# EAGLE design airball_sensor_board_v7 (EAGLE 9.4.2)

## Sheet 1 of 3
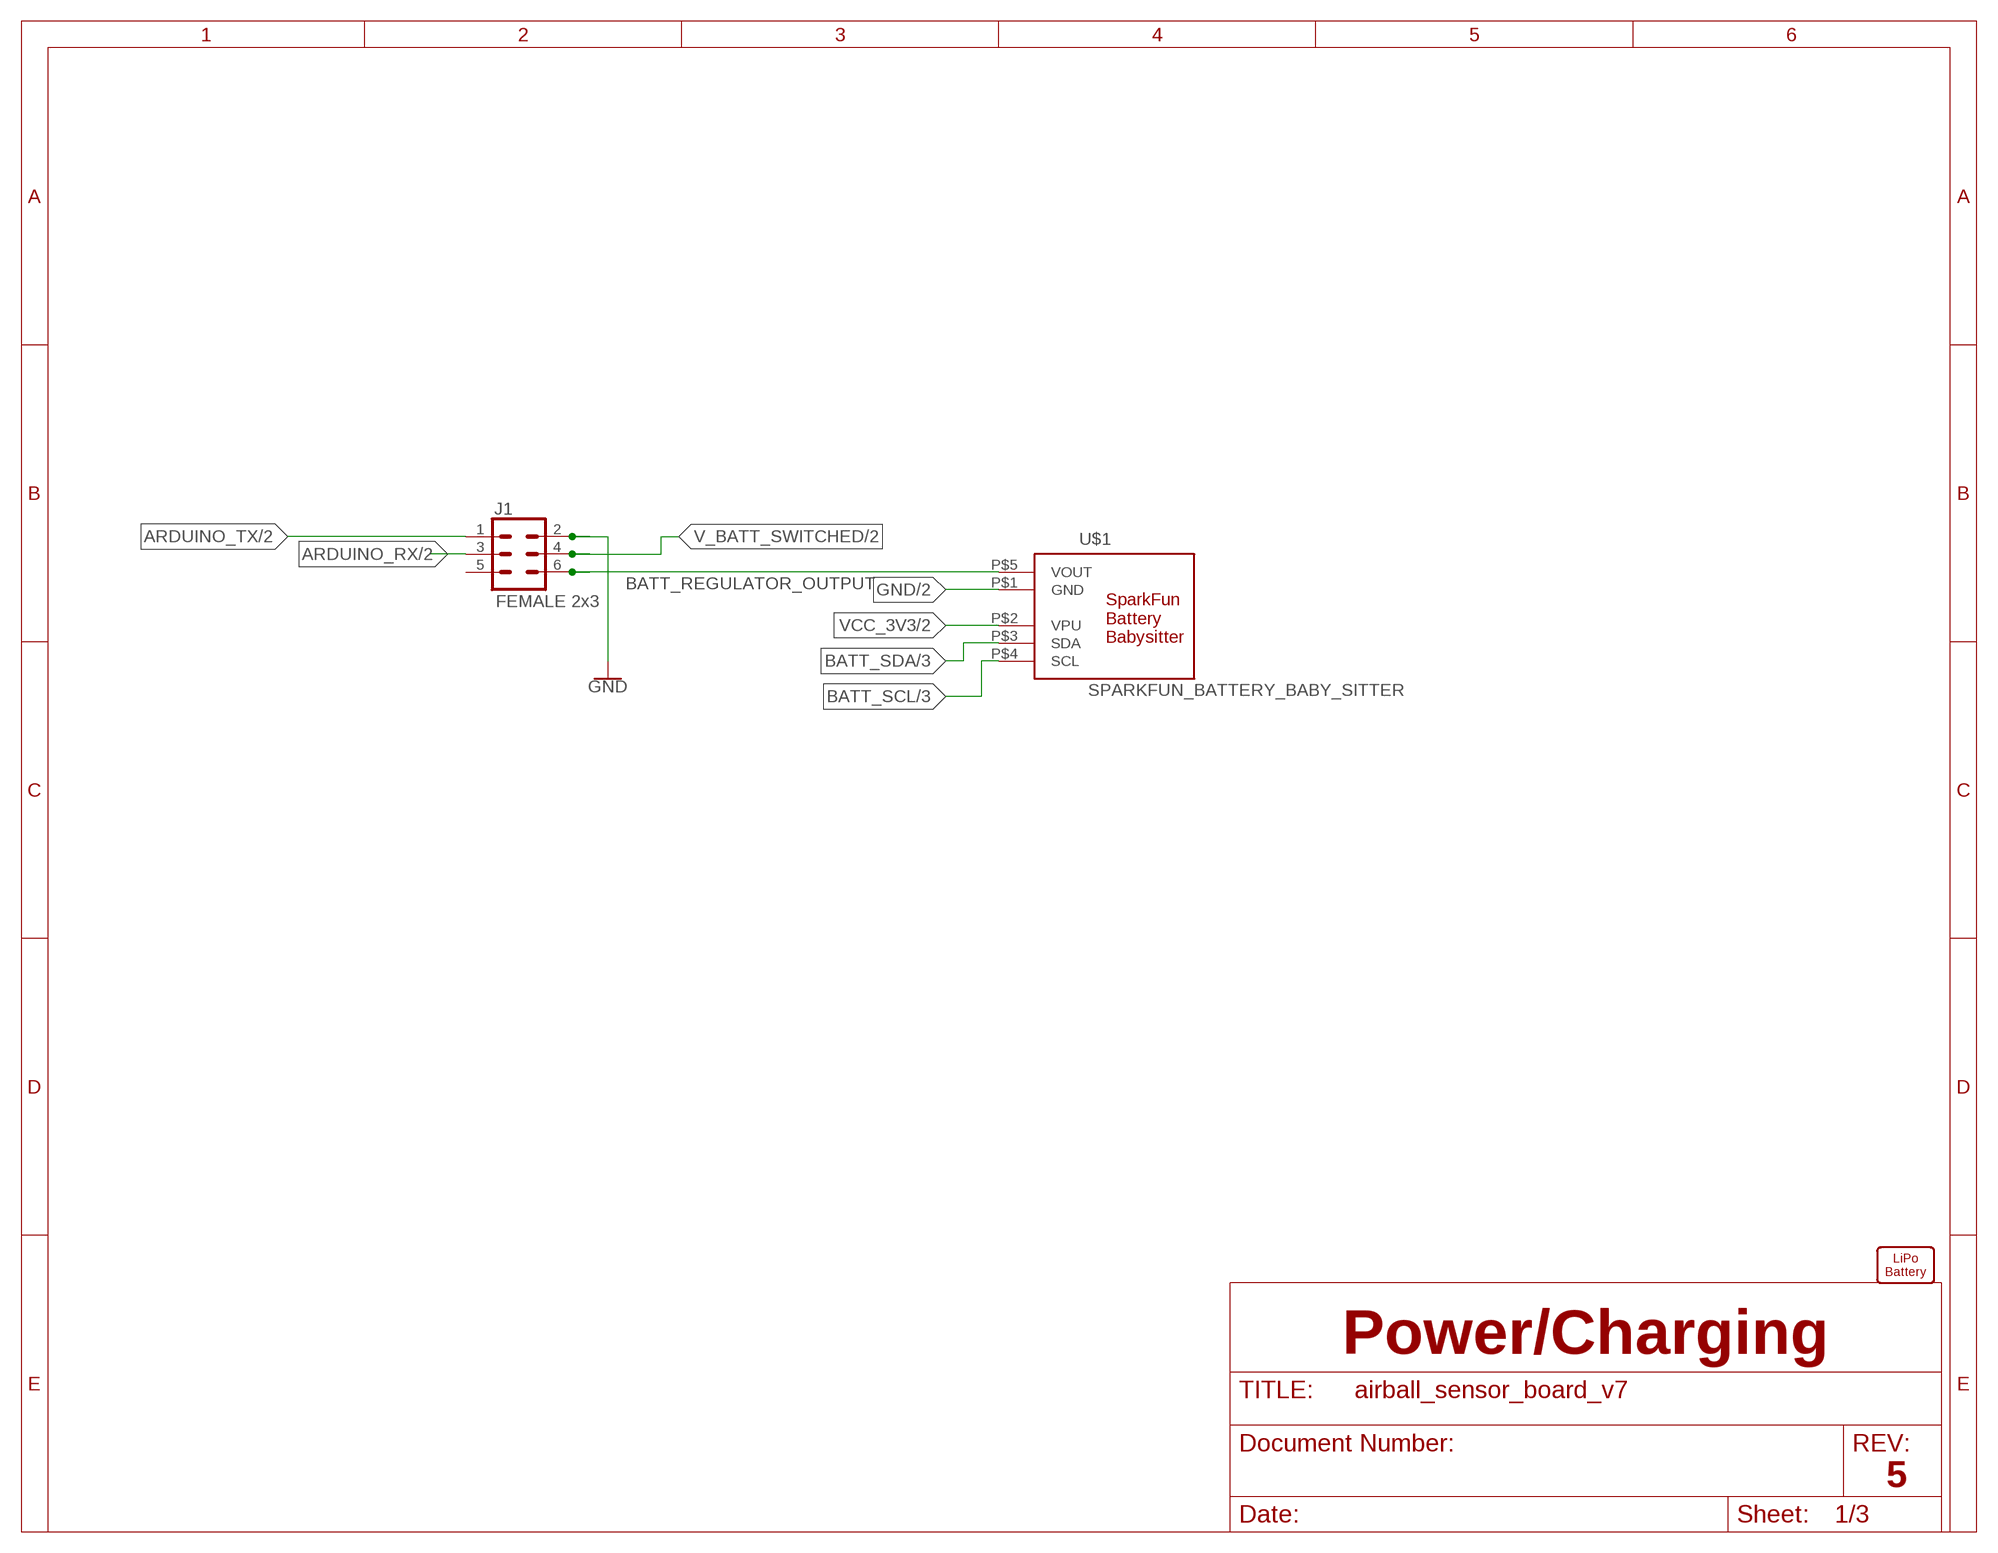
[diagram p0: schematic, sheet 1]

### Parts
J1  FEMALE 2x3  CONN_03X2FEMALE  [2X3]
U$1  SPARKFUN_BATTERY_BABY_SITTER  [SPARKFUN_BATTERY_BABY_SITTER]
U$3  LIPO_BATTERY_OUTLINE-1000MAH  [SPARKFUN_LIPO_1000MAH]

### Nets
ARDUINO_RX: J1.3 ; also sheet 2
ARDUINO_TX: J1.1 ; also sheet 2
BATT_REGULATOR_OUTPUT: J1.6 U$1.P$5(VOUT)
BATT_SCL: U$1.P$4(SCL) ; also sheet 3
BATT_SDA: U$1.P$3(SDA) ; also sheet 3
GND [power]: J1.2 U$1.P$1(GND) ; also sheet 2,3
V_BATT_SWITCHED: J1.4 ; also sheet 2
VCC_3V3 [power]: U$1.P$2(VPU) ; also sheet 2,3
Unconnected: J1.5

### Notes on the sheet
- Power/Charging
- 5

## Sheet 2 of 3
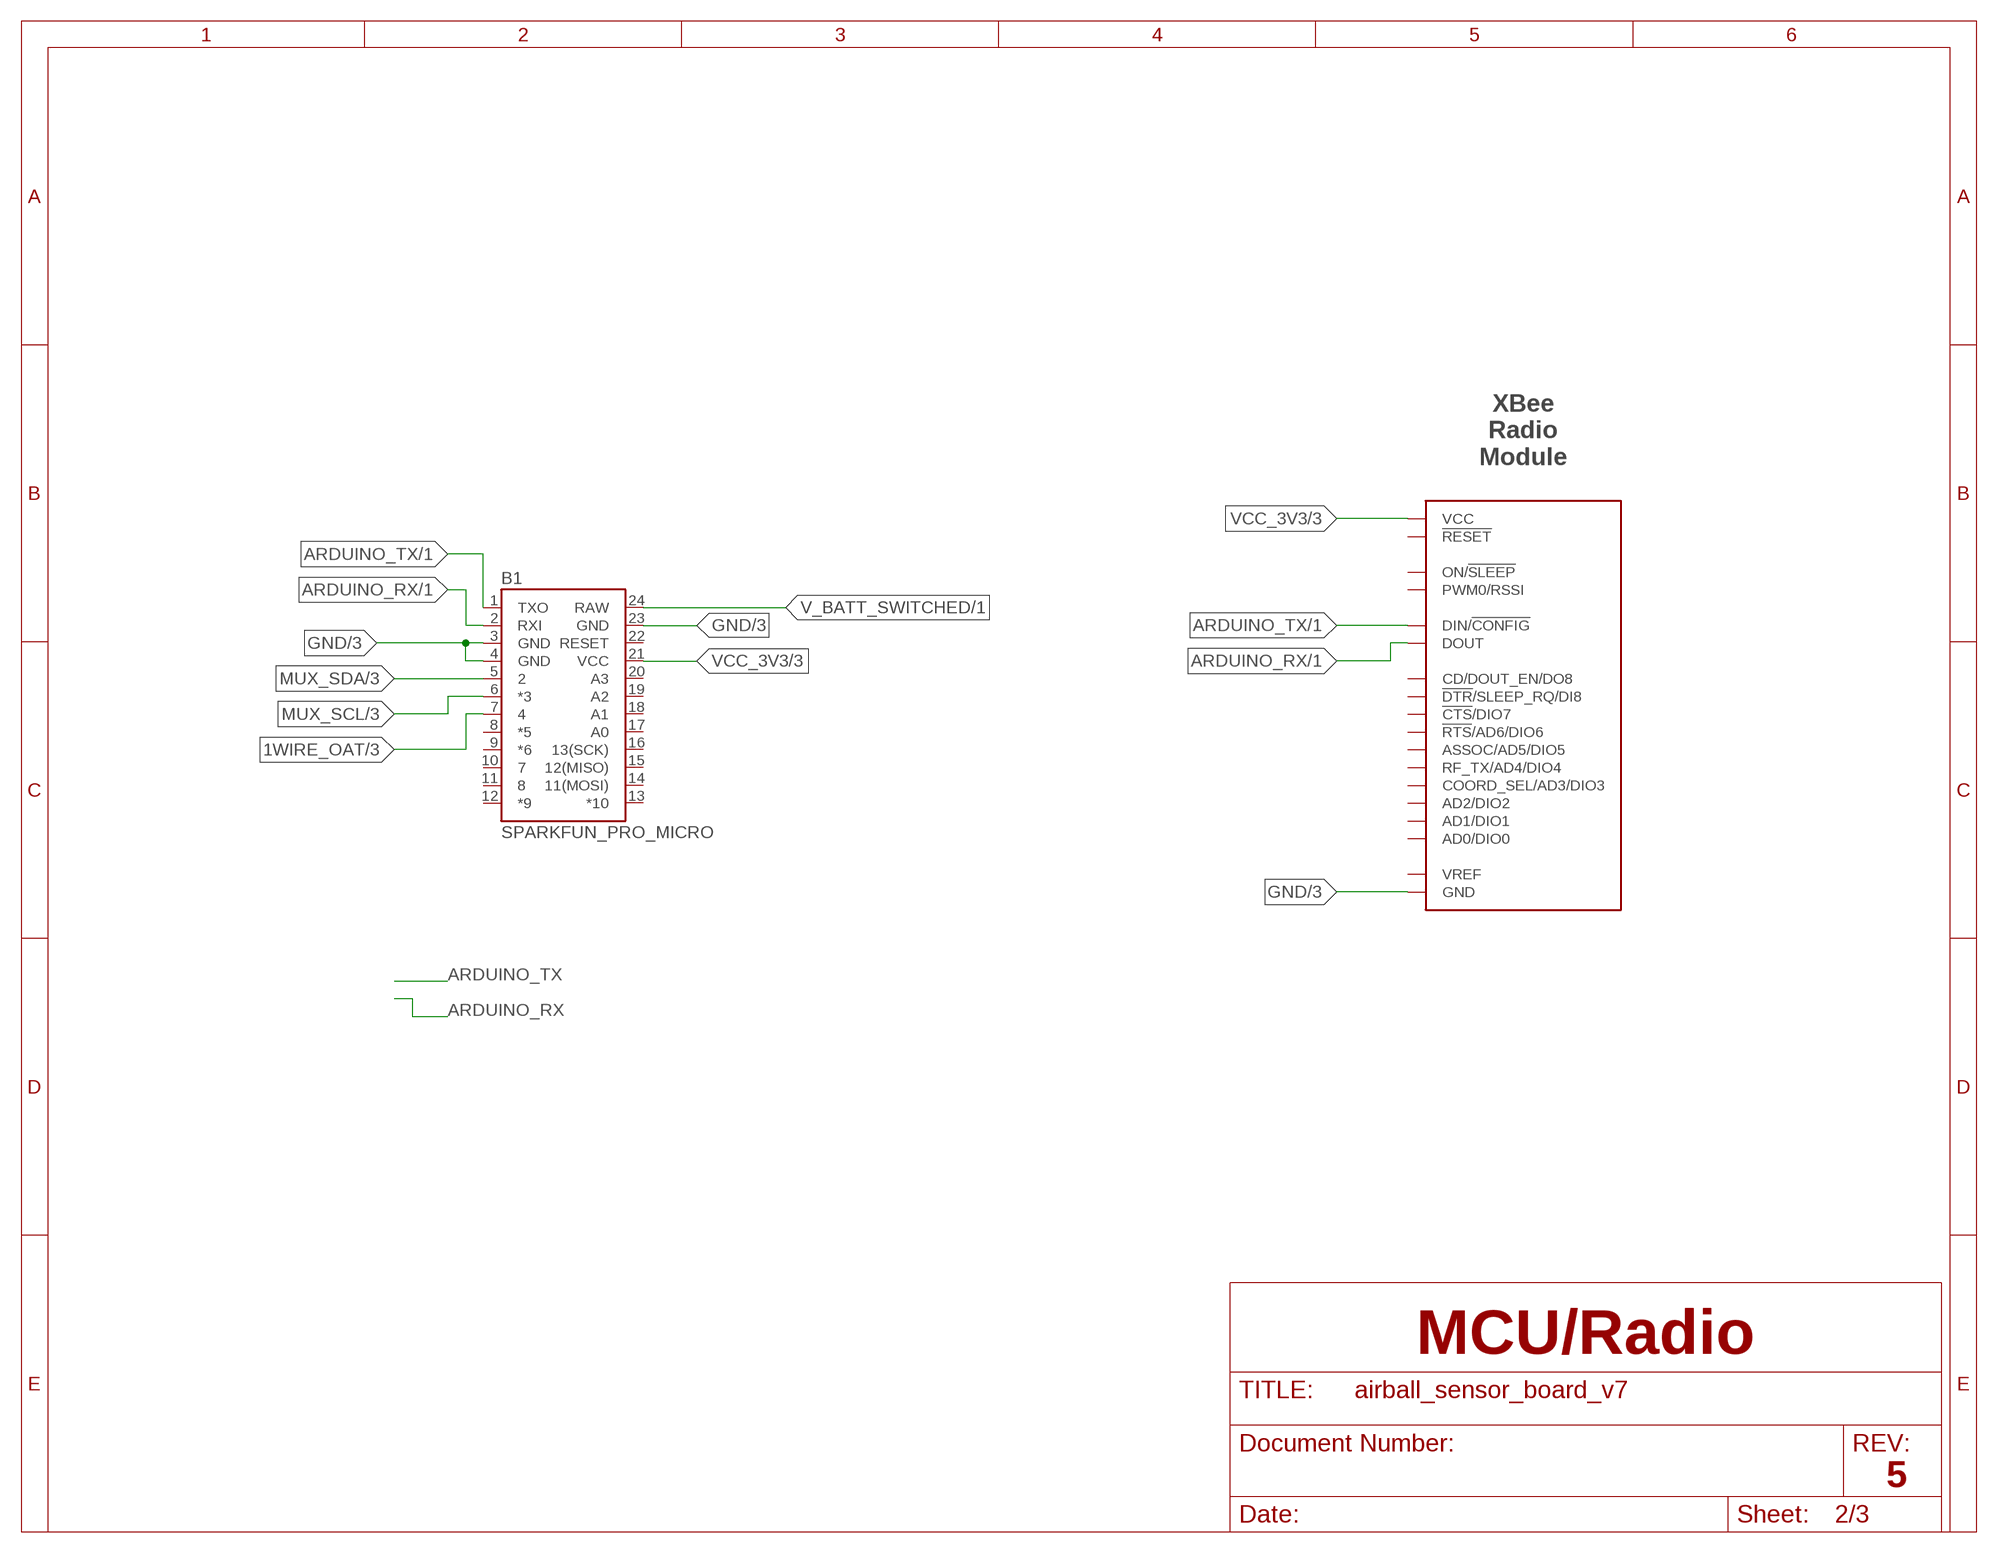
[diagram p1: schematic, sheet 2]

### Parts
B1  SPARKFUN_PRO_MICRO  [SPARKFUN_PRO_MICRO]
XBEE  XBEE-PRO-SMD  [XBEE-PRO-SMD]

### Nets
1WIRE_OAT: B1.7 ; also sheet 3
ARDUINO_RX: B1.2(RXI) XBEE.2(DOUT) ; also sheet 1
ARDUINO_TX: B1.1(TXO) XBEE.3(DIN/!CONFIG) ; also sheet 1
GND [power]: B1.3(GND) B1.4(GND) B1.23(GND) XBEE.10(GND) ; also sheet 1,3
MUX_SCL: B1.6(*3) ; also sheet 3
MUX_SDA: B1.5 ; also sheet 3
V_BATT_SWITCHED: B1.24(RAW) ; also sheet 1
VCC_3V3 [power]: B1.21(VCC) XBEE.1(VCC) ; also sheet 1,3
Unconnected: B1.8(*5) B1.9(*6) B1.10 B1.11 B1.12(*9) B1.13(*10) B1.14(11(MOSI)) B1.15(12(MISO)) B1.16(13(SCK)) B1.17(A0) B1.18(A1) B1.19(A2) B1.20(A3) B1.22(RESET) XBEE.4(CD/DOUT_EN/DO8) XBEE.5(!RESET) XBEE.6(PWM0/RSSI) XBEE.9(!DTR!/SLEEP_RQ/DI8) XBEE.11(RF_TX/AD4/DIO4) XBEE.12(!CTS!/DIO7) XBEE.13(ON/!SLEEP) XBEE.14(VREF) XBEE.15(ASSOC/AD5/DIO5) XBEE.16(!RTS!/AD6/DIO6) XBEE.17(COORD_SEL/AD3/DIO3) XBEE.18(AD2/DIO2) XBEE.19(AD1/DIO1) XBEE.20(AD0/DIO0)

### Notes on the sheet
- XBee
  Radio
  Module
- MCU/Radio
- 5

## Sheet 3 of 3
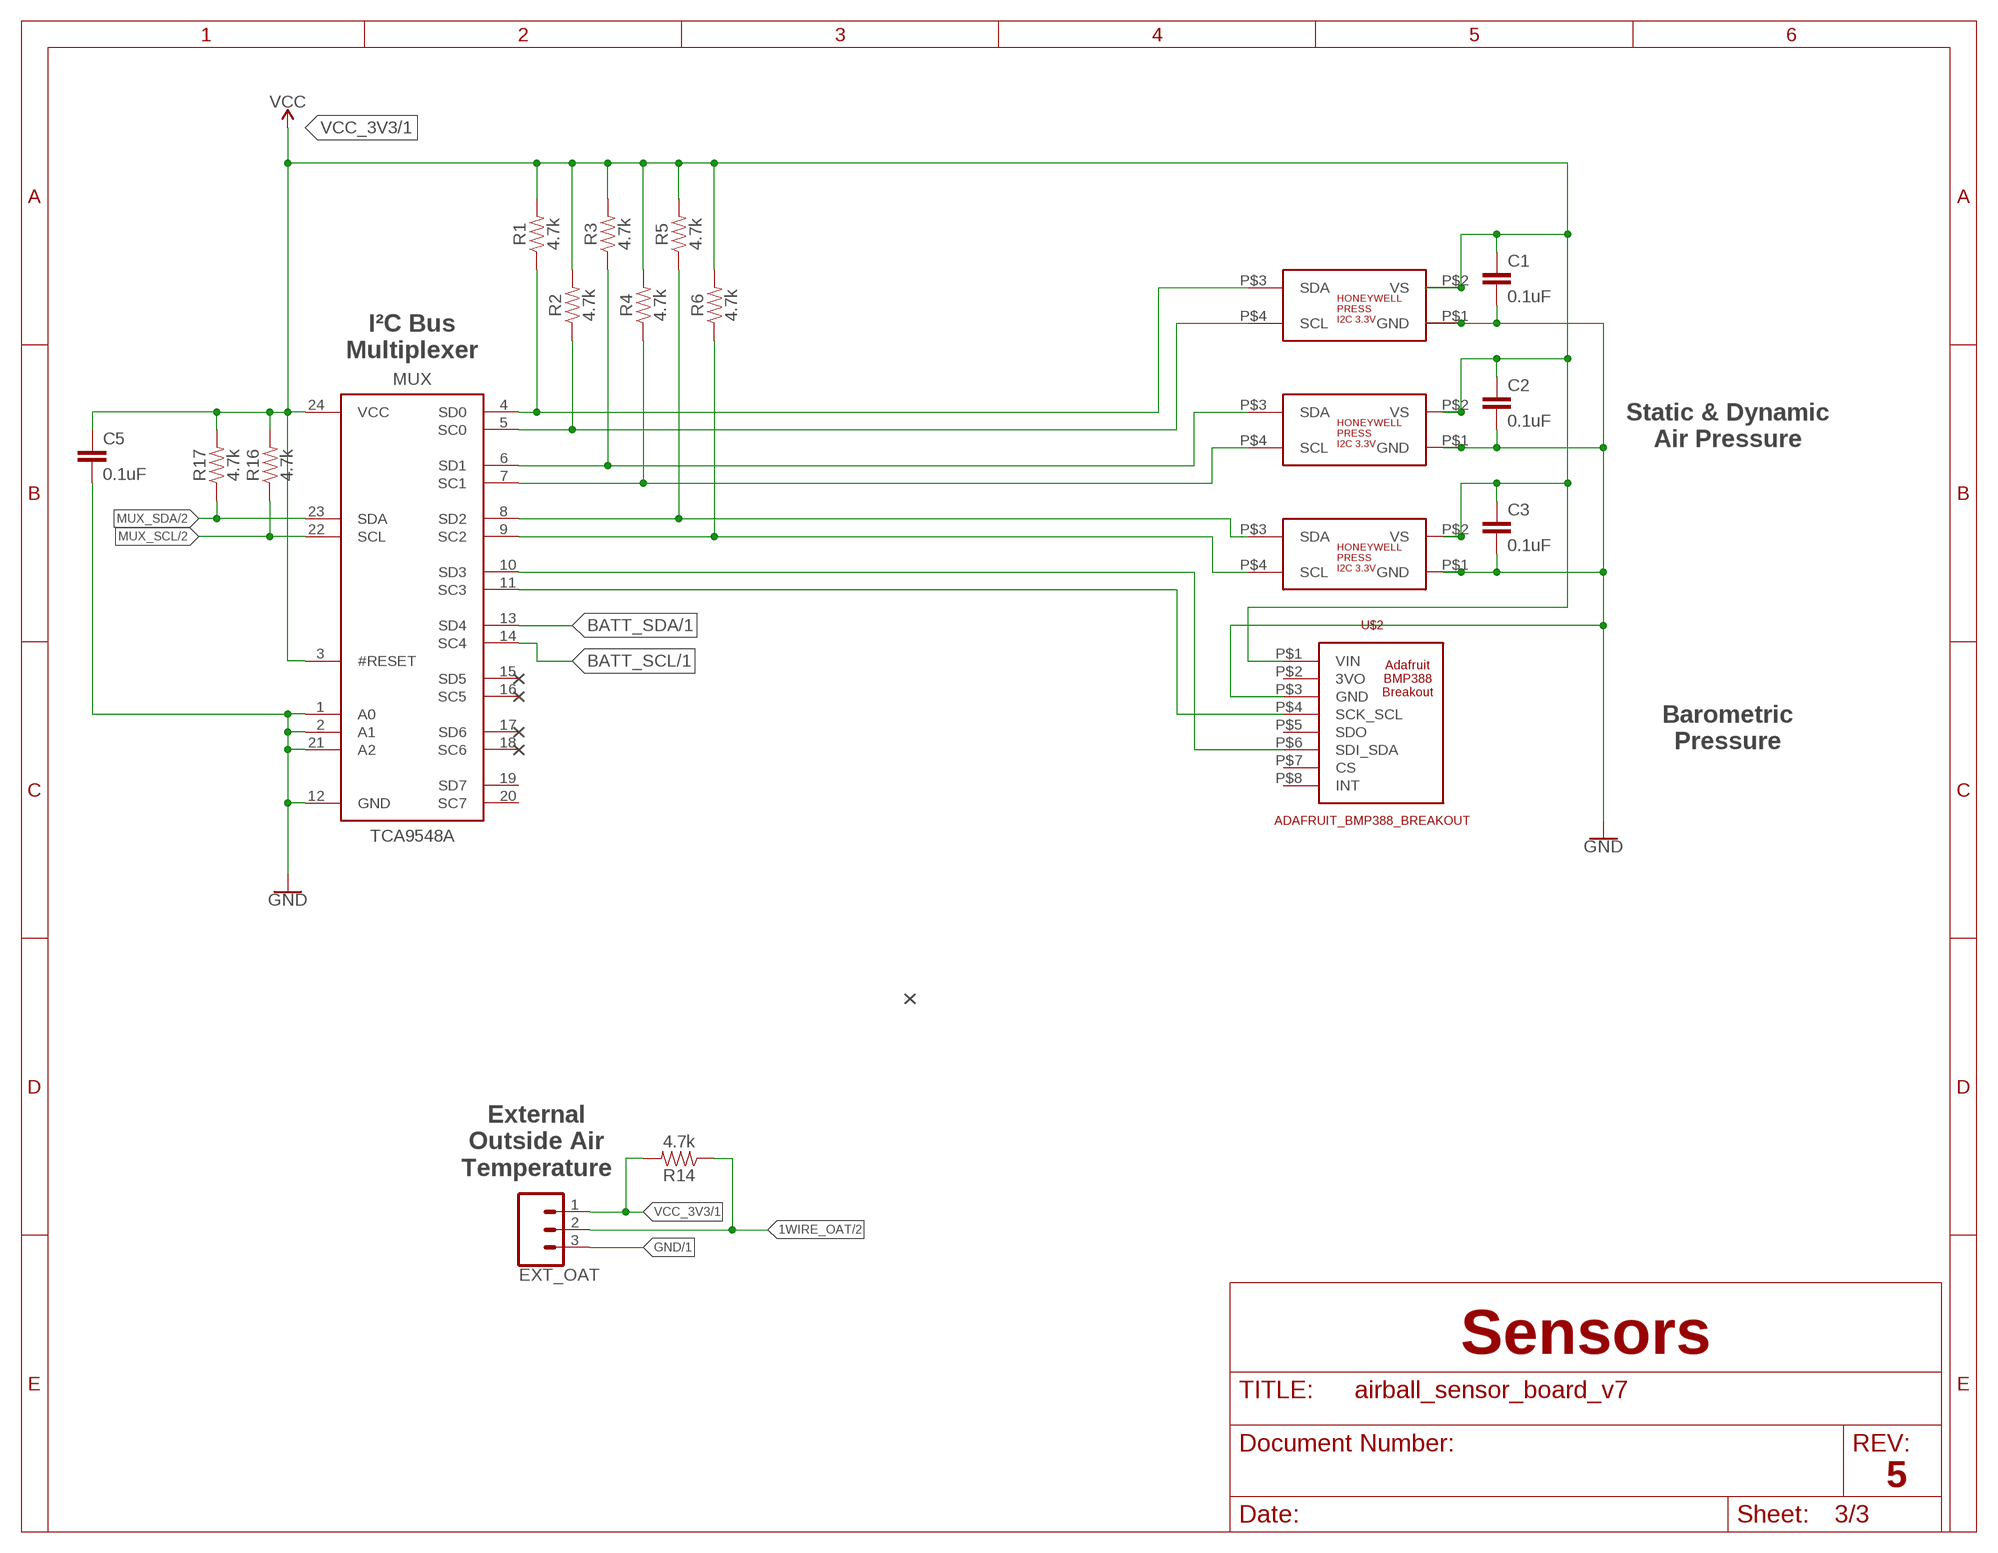
[diagram p2: schematic, sheet 3]

### Parts
C1  0.1uF  0.1UF-0603-25V-5%  [0603]
C2  0.1uF  0.1UF-0603-25V-5%  [0603]
C3  0.1uF  0.1UF-0603-25V-5%  [0603]
C5  0.1uF  0.1UF-0603-25V-5%  [0603]
DP0  HONEYWELL_TRUSTABILITY_I2C_3.3V  [HONEYWELL_TRUSTABILITY_DIP_RR]
DPA  HONEYWELL_TRUSTABILITY_I2C_3.3V  [HONEYWELL_TRUSTABILITY_DIP_RR]
DPB  HONEYWELL_TRUSTABILITY_I2C_3.3V  [HONEYWELL_TRUSTABILITY_DIP_RR]
EXT_OAT  CONN_03  [1X03]
MUX  TCA9548A  TCA9548ATSSOP24  [TSSOP24]
R1  4.7k  4.7KOHM-0603-1/10W-1%  [0603]
R2  4.7k  4.7KOHM-0603-1/10W-1%  [0603]
R3  4.7k  4.7KOHM-0603-1/10W-1%  [0603]
R4  4.7k  4.7KOHM-0603-1/10W-1%  [0603]
R5  4.7k  4.7KOHM-0603-1/10W-1%  [0603]
R6  4.7k  4.7KOHM-0603-1/10W-1%  [0603]
R14  4.7k  4.7KOHM-0603-1/10W-1%  [0603]
R16  4.7k  4.7KOHM-0603-1/10W-1%  [0603]
R17  4.7k  4.7KOHM-0603-1/10W-1%  [0603]
U$2  ADAFRUIT_BMP388_BREAKOUT  [ADAFRUIT_BMP388_BREAKOUT]

### Nets
1WIRE_OAT: EXT_OAT.2 R14.1 ; also sheet 2
BATT_SCL: MUX.14(SC4) ; also sheet 1
BATT_SDA: MUX.13(SD4) ; also sheet 1
GND [power]: C1.2 C2.2 C3.2 C5.2 DP0.P$1(GND) DPA.P$1(GND) DPB.P$1(GND) EXT_OAT.3 MUX.1(A0) MUX.2(A1) MUX.12(GND) MUX.21(A2) U$2.P$3(GND) ; also sheet 1,2
MUX_SCL: MUX.22(SCL) R16.1 ; also sheet 2
MUX_SDA: MUX.23(SDA) R17.1 ; also sheet 2
SCL_BMP_BARO: MUX.11(SC3) U$2.P$4(SCK_SCL)
SCL_DP0: DP0.P$4(SCL) MUX.5(SC0) R2.1
SCL_DPA: DPA.P$4(SCL) MUX.7(SC1) R4.1
SCL_DPB: DPB.P$4(SCL) MUX.9(SC2) R6.1
SDA_BMP_BARO: MUX.10(SD3) U$2.P$6(SDI_SDA)
SDA_DP0: DP0.P$3(SDA) MUX.4(SD0) R1.1
SDA_DPA: DPA.P$3(SDA) MUX.6(SD1) R3.1
SDA_DPB: DPB.P$3(SDA) MUX.8(SD2) R5.1
VCC_3V3 [power]: C1.1 C2.1 C3.1 C5.1 DP0.P$2(VS) DPA.P$2(VS) DPB.P$2(VS) EXT_OAT.1 MUX.3(#RESET) MUX.24(VCC) R1.2 R2.2 R3.2 R4.2 R5.2 R6.2 R14.2 R16.2 R17.2 U$2.P$1(VIN) ; supply symbol labelled VCC ; also sheet 1,2
Unconnected: MUX.15(SD5) MUX.16(SC5) MUX.17(SD6) MUX.18(SC6) MUX.19(SD7) MUX.20(SC7) U$2.P$2(3VO) U$2.P$5(SDO) U$2.P$7(CS) U$2.P$8(INT)

### Notes on the sheet
- I²C Bus
  Multiplexer
- Static & Dynamic
  Air Pressure
- ×
- ×
- ×
- ×
- Barometric
  Pressure
- ×
- External
  Outside Air
  Temperature
- Sensors
- 5

## Library data of the parts
B1 = SparkFun-Boards:SPARKFUN_PRO_MICRO: SparkFun Pro Micro Atmega32U4 compatible footprint. SparkFun Products: 3.3V/8MHz <https://www.sparkfun.com/products/12587> 5V/16MHz <https://www.sparkfun.com/products/12640>
C1-C3 C5 = SparkFun-Capacitors:0.1UF: 0.1µF ceramic capacitors A capacitor is a passive two-terminal electrical component used to store electrical energy temporarily in an electric field.; PROD_ID: CAP-08604
DP0 DPA DPB = airball:HONEYWELL_TRUSTABILITY_I2C_3.3V
EXT_OAT = SparkFun-Connectors:CONN_03: Multi connection point. Often used as Generic Header-pin footprint for 0.1 inch spaced/style header connections On any of the 0.1 inch spaced packages, you can populate with these: Break Away Headers - Straight <https://www.sparkfun.com/products/116> (PRT-00116) Break Away Male Headers - Right Angle <https://www.sparkfun.com/products/553> (PRT-00553) Female Headers <https://www.sparkfun.com/products/115> (PRT-00115) Break Away Headers - Machine Pin <https://www.sparkfun.com/products/117> (PRT-00117) Break Away Female Headers - Swiss Machine Pin <https://www.sparkfun.com/products/743> (PRT-00743) Stackable Header - 3 Pin (Female, 0.1") <https://www.sparkfun.com/products/13875> (PRT-13875) For SCREWTERMINALS and SPRING TERMINALS visit here: Screw Terimnals on SparkFun.com <https://www.sparkfun.com/search/results?term=Screw+Terminals> (5mm/3.5mm/2.54mm spacing) This device is also useful as a general connection point to wire up your design to another part of your project. Our various solder wires solder well into these plated through hole pads. Hook-Up Wire - Assortment (Stranded, 22 AWG) <https://www.sparkfun.com/products/11375> (PRT-11375) Hook-Up Wire - Assortment (Solid Core, 22 AWG) <https://www.sparkfun.com/products/11367> (PRT-11367) View the entire wire category on our website here <https://www.sparkfun.com/categories/141> Special notes: Molex polarized connector foot print use with SKU : PRT-08232 with associated crimp pins and housings.; PROD_ID: XXX-00000; VALUE: 455-1750-1-ND
J1 = SparkFun-Connectors:CONN_03X2: Multi connection point. Often used as Generic Header-pin footprint for 0.1 inch spaced/style header connections You can populate with any combo of single row headers, but if you'd like an exact match, check these: Header - 2x3 (Male, 0.1") <https://www.sparkfun.com/products/12807> (PRT-12807) Header - 2x3 (Female, 0.1") <https://www.sparkfun.com/products/13010> (PRT-13010) 2x3 Pin Shrouded Header <https://www.sparkfun.com/products/10877> (PRT-10877) On any of the 0.1 inch spaced packages, you can populate with these: Break Away Headers - Straight <https://www.sparkfun.com/products/116> (PRT-00116) Break Away Male Headers - Right Angle <https://www.sparkfun.com/products/553> (PRT-00553) Female Headers <https://www.sparkfun.com/products/115> (PRT-00115) Break Away Headers - Machine Pin <https://www.sparkfun.com/products/117> (PRT-00117) Break Away Female Headers - Swiss Machine Pin <https://www.sparkfun.com/products/743> (PRT-00743) Special note: the shrouded connector mates well with our 3x2 ribbon cables: Ribbon Crimp Connector - 6-pin (2x3, Female) <https://www.sparkfun.com/products/10651> (PRT-10651) Ribbon Cable - 6 wire (15ft) <https://www.sparkfun.com/products/10646> (PRT-10646); PROD_ID: CONN-11566
MUX = airball:TCA9548A: Texas Instruments TCA9548A 1-to-8 I2C multiplexer. Supported packages: TSSOP24
R1-R6 R14 R16 R17 = SparkFun-Resistors:4.7KOHM: 4.7kΩ resistor A resistor is a passive two-terminal electrical component that implements electrical resistance as a circuit element. Resistors act to reduce current flow, and, at the same time, act to lower voltage levels within circuits. - Wikipedia; PROD_ID: RES-07857
U$1 = airball:SPARKFUN_BATTERY_BABY_SITTER
U$2 = airball:ADAFRUIT_BMP388_BREAKOUT
U$3 = airball:LIPO_BATTERY_OUTLINE
XBEE = airball:XBEE: XBee (TM) /XBee-PRO(TM) OEM RF Modules Source: MaxStream, Inc. xbee_productmanual.pdf

## Net classes
0 signal: width 0.152 mm
1 power: width 0.305 mm
2 battery: width 0.381 mm

## Board
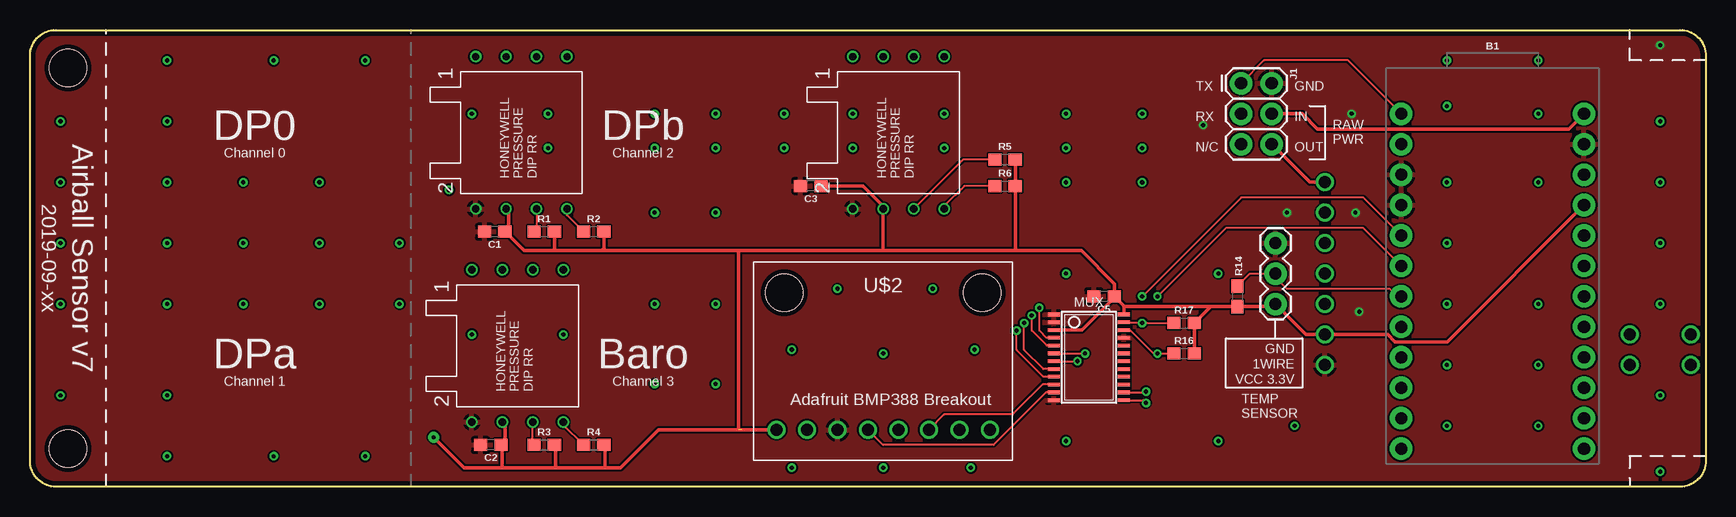
[diagram p3: board, top side]
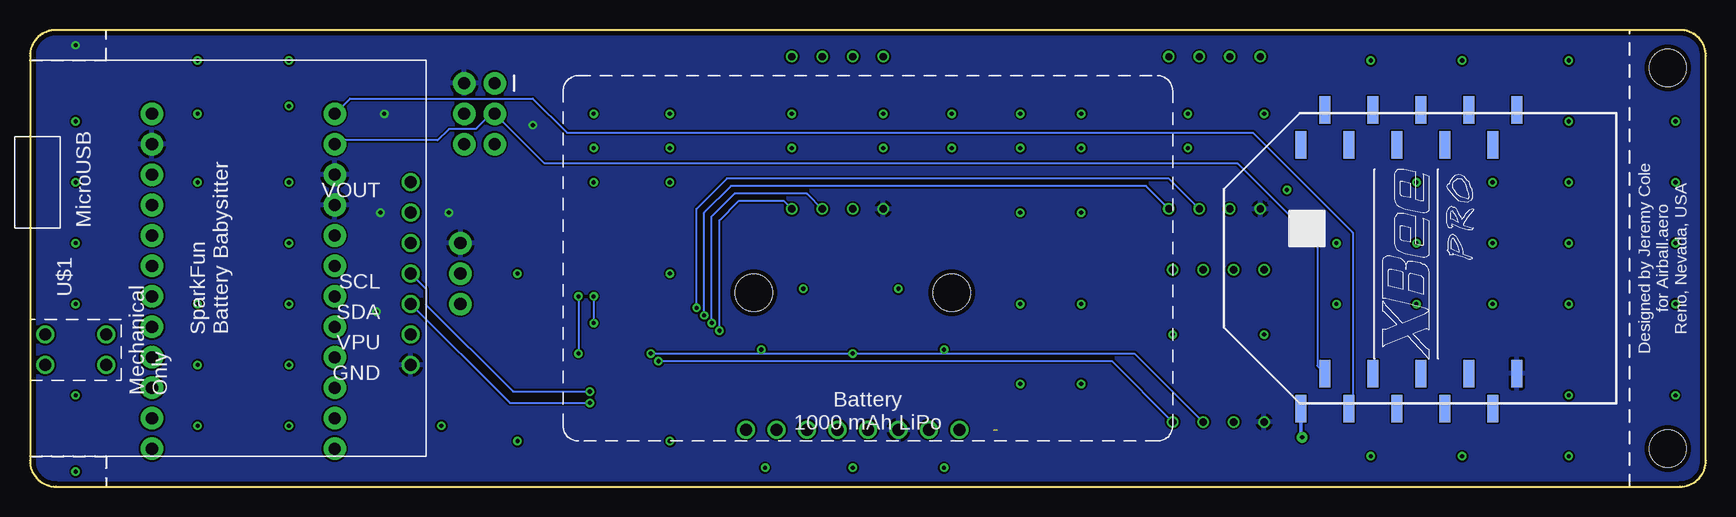
[diagram p4: board, bottom side, seen from below]

Size 139.7 x 38.1 mm. Coordinates in mm from the lower left corner, seen from the top.
Outline: 2.17,38.1 137.53,38.1 arc-90 139.7,35.93 139.7,2.17 arc-90 137.53,0 2.17,0 arc-90 0,2.17 0,35.93 arc-90 2.17,38.1
Copper layers (1*16): Top 0.0356mm / dielectric 1.5011mm / Bottom 0.0356mm
Design rules "oshpark-2layer *": minimum track width 6mil, minimum drill 13mil, track to track 6mil, track to pad 6mil, pad to pad 6mil, via to via 6mil, smd to smd 6mil, copper to edge 15mil, drill to drill 6mil, minimum pad ring 7mil, minimum via ring 7mil, stop-mask expansion 2.5mil, vias tented up to drill 15mil, thermal gap 10mil
Holes 3.1 mm at 3.17,34.92 3.17,3.17

### Footprints (pad centres in the part's own frame; a part is rotated, then mirrored left to right if it is on the bottom)
SPARKFUN_PRO_MICRO = drill 1.016 pad 1.88: 1 -7.62,12.7; 2 -7.62,10.16; 3 -7.62,7.62; 4 -7.62,5.08; 5 -7.62,2.54; 6 -7.62,0; 7 -7.62,-2.54; 8 -7.62,-5.08; 9 -7.62,-7.62; 10 -7.62,-10.16; 11 -7.62,-12.7; 12 -7.62,-15.24; 13 7.62,-15.24; 14 7.62,-12.7; 15 7.62,-10.16; 16 7.62,-7.62; 17 7.62,-5.08; 18 7.62,-2.54; 19 7.62,0; 20 7.62,2.54; 21 7.62,5.08; 22 7.62,7.62; 23 7.62,10.16; 24 7.62,12.7
0603 = smd 1.1 x 1: 1 -0.85,0; 2 0.85,0
HONEYWELL_TRUSTABILITY_DIP_RR = drill 0.6: P$1 -6.35,3.81; P$2 -6.35,1.27; P$3 -6.35,-1.27; P$4 -6.35,-3.81; P$5 6.35,-3.81; P$6 6.35,-1.27; P$7 6.35,1.27; P$8 6.35,3.81
1X03 = drill 1.016 pad 1.88: 1 0,0; 2 2.54,0; 3 5.08,0
2X3 = drill 1.016 pad 1.88: 1 0,0; 2 0,2.54; 3 2.54,0; 4 2.54,2.54; 5 5.08,0; 6 5.08,2.54
TSSOP24 = smd 0.305 x 0.991: 1 -3.575,-2.918; 2 -2.925,-2.918; 3 -2.275,-2.918; 4 -1.625,-2.918; 5 -0.975,-2.918; 6 -0.325,-2.918; 7 0.325,-2.918; 8 0.975,-2.918; 9 1.625,-2.918; 10 2.275,-2.918; 11 2.925,-2.918; 12 3.575,-2.918; 13 3.575,2.918; 14 2.925,2.918; 15 2.275,2.918; 16 1.625,2.918; 17 0.975,2.918; 18 0.325,2.918; 19 -0.325,2.918; 20 -0.975,2.918; 21 -1.625,2.918; 22 -2.275,2.918; 23 -2.925,2.918; 24 -3.575,2.918
SPARKFUN_BATTERY_BABY_SITTER = drill 1: P$1 0,0; P$2 2.54,0; P$3 5.08,0; P$4 7.62,0; P$5 15.24,0; P$6 10.16,0; P$7 12.7,0; P$8 0,25.4; P$9 0,30.48; P$10 2.54,30.48; P$11 2.54,25.4
ADAFRUIT_BMP388_BREAKOUT = drill 1: P$1 1.905,2.54; P$2 4.445,2.54; P$3 6.985,2.54; P$4 9.525,2.54; P$5 12.065,2.54; P$6 14.605,2.54; P$7 17.145,2.54; P$8 19.685,2.54 | hole 3.099: 2.54,13.97; 19.05,13.97
XBEE-PRO-SMD = smd 2.29 x 0.89: 1 -12.54,9; 2 -9.605,7; 3 -12.54,5; 4 -9.605,3; 5 -12.54,1; 6 -9.605,-1; 7 -12.54,-3; 8 -9.605,-5; 9 -12.54,-7; 10 -9.605,-9; 11 12.395,-9; 12 9.46,-7; 13 12.395,-5; 14 9.46,-3; 15 12.395,-1; 16 9.46,1; 17 12.395,3; 18 9.46,5; 19 12.395,7; 20 9.46,9

### Placement (x,y rotation side)
B1  121.92,18.41 0 top
C1  38.73,21.27 180 top
C2  38.42,3.49 180 top
C3  65.09,25.08 180 top
C5  89.53,15.88 180 top
DP0  40.96,29.53 90 top
DPA  40.64,11.75 90 top
DPB  72.39,29.53 90 top
EXT_OAT  103.82,15.24 90 top
J1  100.97,33.66 270 top
MUX  88.27,10.79 270 top
R1  42.86,21.27 0 top
R2  46.99,21.27 0 top
R3  42.86,3.49 0 top
R4  46.99,3.49 0 top
R5  81.28,27.3 0 top
R6  81.28,25.08 0 top
R14  100.65,15.88 270 top
R16  96.2,11.11 0 top
R17  96.2,13.65 0 top
U$1  107.95,10.16 90 bottom
U$2  60.33,2.22 0 top
U$3  69.85,19.05 0 bottom
XBEE  24.77,19.05 90 bottom

### Tracks (layer width: path | path; a pad name or v marks a point on that pad's centre or on a via)
1WIRE_OAT
  Top 0.152: B1.7 113.98,15.88 113.35,16.51 104.78,16.51 103.82,17.46 EXT_OAT.2 101.7,17.78 R14.1
ARDUINO_RX
  Bottom 0.152: B1.2 113.98,28.89 105.73,28.89 104.78,29.84 102.55,29.84 101.28,31.11 J1.3 96.84,26.99 39.05,26.99 32.4,20.34 32.4,10.08 XBEE.2
ARDUINO_TX
  Top 0.152: B1.1 109.86,35.56 102.87,35.56 J1.1
  Bottom 0.152: B1.1 113.03,32.38 97.79,32.38 94.93,29.53 37.78,29.53 29.45,21.19 29.45,6.83 XBEE.3
BATT_REGULATOR_OUTPUT
  Top 0.305: U$1.P$5 106.68,25.4 J1.6
BATT_SCL  (via drill 0.35)
  Top 0.152: MUX.14 92.96,7.87 v93.03,7.94
  Bottom 0.152: U$1.P$4 106.68,16.51 106.68,15.18 99.44,7.94 v93.03,7.94
BATT_SDA  (via drill 0.35)
  Top 0.152: MUX.13 92.79,7.22 v93.03,6.99
  Bottom 0.152: U$1.P$3 99.69,6.99 v93.03,6.99
GND  (via drill 0.35)
  other vias: 110.81,14.61 104.78,22.86 110.49,22.86 135.89,36.83 97.79,30.16 110.17,31.11
  pour Top (isolate 0.152): 0,38.1 139.7,38.1 139.7,0 0,0
  pour Bottom: 0,38.1 139.7,38.1 139.7,0 0,0
GND1  (via drill 0.35)
  other vias: 135.89,1.27
GND2  (via drill 0.35)
  other vias: 135.89,20.32
GND3  (via drill 0.35)
  other vias: 135.89,30.48
GND4  (via drill 0.35)
  other vias: 135.89,7.62
GND5  (via drill 0.35)
  other vias: 135.89,15.24
GND6  (via drill 0.35)
  other vias: 135.89,25.4
GND7  (via drill 0.35)
  other vias: 118.11,31.75
GND8  (via drill 0.35)
  other vias: 125.73,31.11
GND9  (via drill 0.35)
  other vias: 125.73,25.4
GND10  (via drill 0.35)
  other vias: 118.11,25.4
GND11  (via drill 0.35)
  other vias: 118.11,20.32
GND12  (via drill 0.35)
  other vias: 118.11,15.24
GND13  (via drill 0.35)
  other vias: 125.73,15.24
GND14  (via drill 0.35)
  other vias: 125.73,10.16
GND15  (via drill 0.35)
  other vias: 118.11,10.16
GND16  (via drill 0.35)
  other vias: 118.11,5.08
GND17  (via drill 0.35)
  other vias: 125.73,5.08
GND18  (via drill 0.35)
  other vias: 118.11,35.56
GND19  (via drill 0.35)
  other vias: 125.73,35.56
GND20  (via drill 0.35)
  other vias: 92.71,31.11
GND21  (via drill 0.35)
  other vias: 86.36,31.11
GND22  (via drill 0.35)
  other vias: 86.36,25.4
GND23  (via drill 0.35)
  other vias: 92.71,25.4
GND24  (via drill 0.35)
  other vias: 99.06,17.78
GND25  (via drill 0.35)
  other vias: 86.36,17.78
GND26  (via drill 0.35)
  other vias: 105.41,5.08
GND27  (via drill 0.35)
  other vias: 86.36,3.81
GND28  (via drill 0.35)
  other vias: 99.06,3.81
GND29  (via drill 0.35)
  other vias: 76.2,31.11
GND30  (via drill 0.35)
  other vias: 68.58,31.11
GND31  (via drill 0.35)
  other vias: 43.18,31.11
GND32  (via drill 0.35)
  other vias: 36.83,31.11
GND33  (via drill 0.35)
  other vias: 44.45,12.7
GND34  (via drill 0.35)
  other vias: 36.83,12.7
GND35  (via drill 0.35)
  other vias: 57.15,31.11
GND36  (via drill 0.35)
  other vias: 52.07,31.11
GND37  (via drill 0.35)
  other vias: 52.07,15.24
GND38  (via drill 0.35)
  other vias: 57.15,15.24
GND39  (via drill 0.35)
  other vias: 52.07,22.86
GND40  (via drill 0.35)
  other vias: 57.15,22.86
GND41  (via drill 0.35)
  other vias: 2.54,30.48
GND42  (via drill 0.35)
  other vias: 2.54,25.4
GND43  (via drill 0.35)
  other vias: 2.54,20.32
GND44  (via drill 0.35)
  other vias: 2.54,15.24
GND45  (via drill 0.35)
  other vias: 2.54,7.62
GND46  (via drill 0.35)
  other vias: 11.43,30.48
GND47  (via drill 0.35)
  other vias: 11.43,25.4
GND48  (via drill 0.35)
  other vias: 11.43,20.32
GND49  (via drill 0.35)
  other vias: 11.43,15.24
GND50  (via drill 0.35)
  other vias: 11.43,7.62
GND51  (via drill 0.35)
  other vias: 11.43,2.54
GND52  (via drill 0.35)
  other vias: 11.43,35.56
GND53  (via drill 0.35)
  other vias: 27.94,35.56
GND54  (via drill 0.35)
  other vias: 27.94,2.54
GND55  (via drill 0.35)
  other vias: 20.32,2.54
GND56  (via drill 0.35)
  other vias: 20.32,35.56
GND57  (via drill 0.35)
  other vias: 17.78,25.4
GND58  (via drill 0.35)
  other vias: 17.78,15.24
GND59  (via drill 0.35)
  other vias: 17.78,20.32
GND60  (via drill 0.35)
  other vias: 24.13,25.4
GND61  (via drill 0.35)
  other vias: 24.13,20.32
GND62  (via drill 0.35)
  other vias: 24.13,15.24
GND63  (via drill 0.35)
  other vias: 62.87,31.11
GND64  (via drill 0.35)
  other vias: 86.36,28.26
GND65  (via drill 0.35)
  other vias: 92.71,28.26
GND66  (via drill 0.35)
  other vias: 76.2,28.26
GND67  (via drill 0.35)
  other vias: 68.58,28.26
GND68  (via drill 0.35)
  other vias: 57.15,28.26
GND69  (via drill 0.35)
  other vias: 52.07,28.26
GND70  (via drill 0.35)
  other vias: 43.18,28.26
GND71  (via drill 0.35)
  other vias: 30.8,20.32
GND72  (via drill 0.35)
  other vias: 30.8,15.24
GND73  (via drill 0.35)
  other vias: 34.92,24.77
GND74  (via drill 0.35)
  other vias: 62.87,28.26
GND75  (via drill 0.35)
  other vias: 57.15,8.57
GND76  (via drill 0.35)
  other vias: 52.07,8.57
GND77  (via drill 0.35)
  other vias: 67.31,16.51
GND78  (via drill 0.35)
  other vias: 75.25,16.51
GND79  (via drill 0.35)
  other vias: 63.5,11.43
GND80  (via drill 0.35)
  other vias: 78.74,11.43
GND81  (via drill 0.35)
  other vias: 63.5,1.59
GND82  (via drill 0.35)
  other vias: 78.42,1.59
GND83  (via drill 0.35)
  other vias: 71.12,1.59
GND84  (via drill 0.35)
  other vias: 71.12,11.11
MUX_SCL  (via drill 0.35)
  Top 0.152: MUX.22 91.7,13.07 93.66,11.11 v93.98,11.11 R16.1 | B1.6 111.12,21.59 99.69,21.59 v93.98,15.88
  Bottom 0.152: v93.98,15.88 v93.98,11.11
MUX_SDA  (via drill 0.35)
  Top 0.152: MUX.23 92.64,13.72 v92.71,13.65 R17.1 | B1.5 111.12,24.13 100.97,24.13 v92.71,15.88
  Bottom 0.152: v92.71,15.88 v92.71,13.65
SCL_BMP_BARO
  Top 0.152: MUX.11 84.7,7.87 80.33,3.49 71.12,3.49 U$2.P$4
SCL_DP0  (via drill 0.35)
  Top 0.152: R2.1 44.77,22.64 DP0.P$4 | MUX.5 84.75,11.77 83.5,13.02 v83.5,14.29
  Bottom 0.152: v83.5,14.29 83.5,22.86 81.28,25.08 46.67,25.08 DP0.P$4
SCL_DPA  (via drill 0.35)
  Top 0.152: MUX.7 v87.31,10.47 v87.31,10.48 | R4.1 44.45,5.18 DPA.P$4
  Bottom 0.152: v87.31,10.48 49.53,10.48 DPA.P$4
SCL_DPB  (via drill 0.35)
  Top 0.152: R6.1 77.89,25.08 76.2,23.39 DPB.P$4 | MUX.9 84.49,9.17 82.23,11.43 v82.23,13.02
  Bottom 0.152: v82.23,13.02 82.23,22.23 80.64,23.81 76.83,23.81 DPB.P$4
SDA_BMP_BARO
  Top 0.152: MUX.10 84.4,8.52 81.92,6.03 76.2,6.03 U$2.P$6
SDA_DP0  (via drill 0.35)
  Top 0.152: R1.1 42.23,21.49 DP0.P$3 | MUX.4 84.73,12.42 84.14,13.02 v84.14,14.92
  Bottom 0.152: v84.14,14.92 84.14,23.18 81.6,25.72 44.77,25.72 DP0.P$3
SDA_DPA  (via drill 0.35)
  Top 0.152: R3.1 41.91,3.6 DPA.P$3 | MUX.6 v87.94,11.12 v87.95,11.11
  Bottom 0.152: v87.95,11.11 47.62,11.11 DPA.P$3
SDA_DPB  (via drill 0.35)
  Top 0.152: DPB.P$3 77.79,27.3 R5.1 | MUX.8 84.48,9.82 82.87,11.43 v82.87,13.65
  Bottom 0.152: v82.87,13.65 82.87,22.54 80.96,24.45 74.93,24.45 DPB.P$3
V_BATT_SWITCHED
  Top 0.305: J1.4 106.05,31.11 107.31,29.84 128.27,29.84 B1.24
VCC_3V3  (via drill 0.35 pad 0.9)  (1 unrouted)
  Top 0.305: R14.2 103.61,15.03 EXT_OAT.1 106.36,12.7 U$1.P$2 113.17,12.7 113.78,12.09 118.14,12.09 B1.21 | R14.2 98.42,15.03 R17.2 R16.2 | 90.44,15.82 91.18,15.08 | 91.18,15.08 MUX.24 | R14.2 91.23,15.03 91.18,15.08 | 90.44,15.82 C5.1 90.39,16.93 87.63,19.68 82.13,19.68 | DP0.P$2 39.9,22.96 39.9,21.59 C1.1 41.17,19.68 43.81,19.68 | DPA.P$2 39.59,5.18 39.59,3.81 C2.1 39.37,3.39 39.37,1.59 | v33.66,4.13 36.2,1.59 39.37,1.59 | 39.37,1.59 43.81,1.59 | 43.81,1.59 47.94,1.59 | 47.94,1.59 49.21,1.59 52.39,4.76 59.37,4.76 | R3.2 43.81,3.39 43.81,1.59 | R4.2 47.94,3.39 47.94,1.59 | 82.13,19.68 71.12,19.68 | 71.12,19.68 59.05,19.68 | 47.62,19.68 43.81,19.68 | R2.2 47.84,19.9 47.62,19.68 | R1.2 43.71,19.79 43.81,19.68 | 82.13,19.68 R6.2 R5.2 | 59.05,19.68 59.05,4.76 U$2.P$1 | 71.12,19.68 DPB.P$2 71.12,23.39 69.43,25.08 C3.1 | 47.62,19.68 59.05,19.68 | MUX.3 87.68,13.07 90.44,15.82
  Bottom 0.305: XBEE.1 33.77,4.24 v33.66,4.13

### Text on the board
tPlace: TX | GND | DP0 | DPb | RX | IN | RAW / PWR | Channel 0 | Channel 2 | N/C | OUT | 2019-09-xx | Airball Sensor v7 | DPa | Baro | GND | 1WIRE | Channel 1 | Channel 3 | VCC 3.3V | TEMP / SENSOR
bPlace: Designed by Jeremy Cole / for Airball.aero / Reno, Nevada, USA